# EAGLE design main (EAGLE 8.6.0)
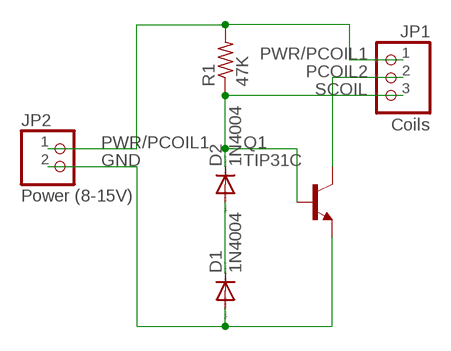
[diagram p0: schematic, sheet 1]

## Parts
D1  1N4004  [DO41-10]
D2  1N4004  [DO41-10]
JP1  Coils  PINHD-1X3  [1X03]
JP2  Power (8-15V)  PINHD-1X2  [1X02]
Q1  TIP31C  [TO220]
R1  47K  R-US_R2512  [R2512]

## Nets
GND: D1.A JP2.2 Q1.3(E)
N$1: D1.C D2.A
PCOIL2: JP1.2 Q1.2(C)
PWR/PCOIL1: JP1.1 JP2.1 R1.2
SCOIL: D2.C JP1.3 Q1.1(B) R1.1

## Library data of the parts
D1 D2 = diode:1N4004: DIODE general purpose rectifier, 1 A
JP1 = pinhead:PINHD-1X3: PIN HEADER
JP2 = pinhead:PINHD-1X2: PIN HEADER; SPICEPREFIX: B
Q1 = transistor-npn:TIP31C*: NPN Transistor
R1 = resistor:R-US_: RESISTOR, American symbol; DIGIKEY: https://www.digikey.com/product-detail/en/yageo/RC2512JK-0747KL/YAG2298CT-ND/5252412

## Board
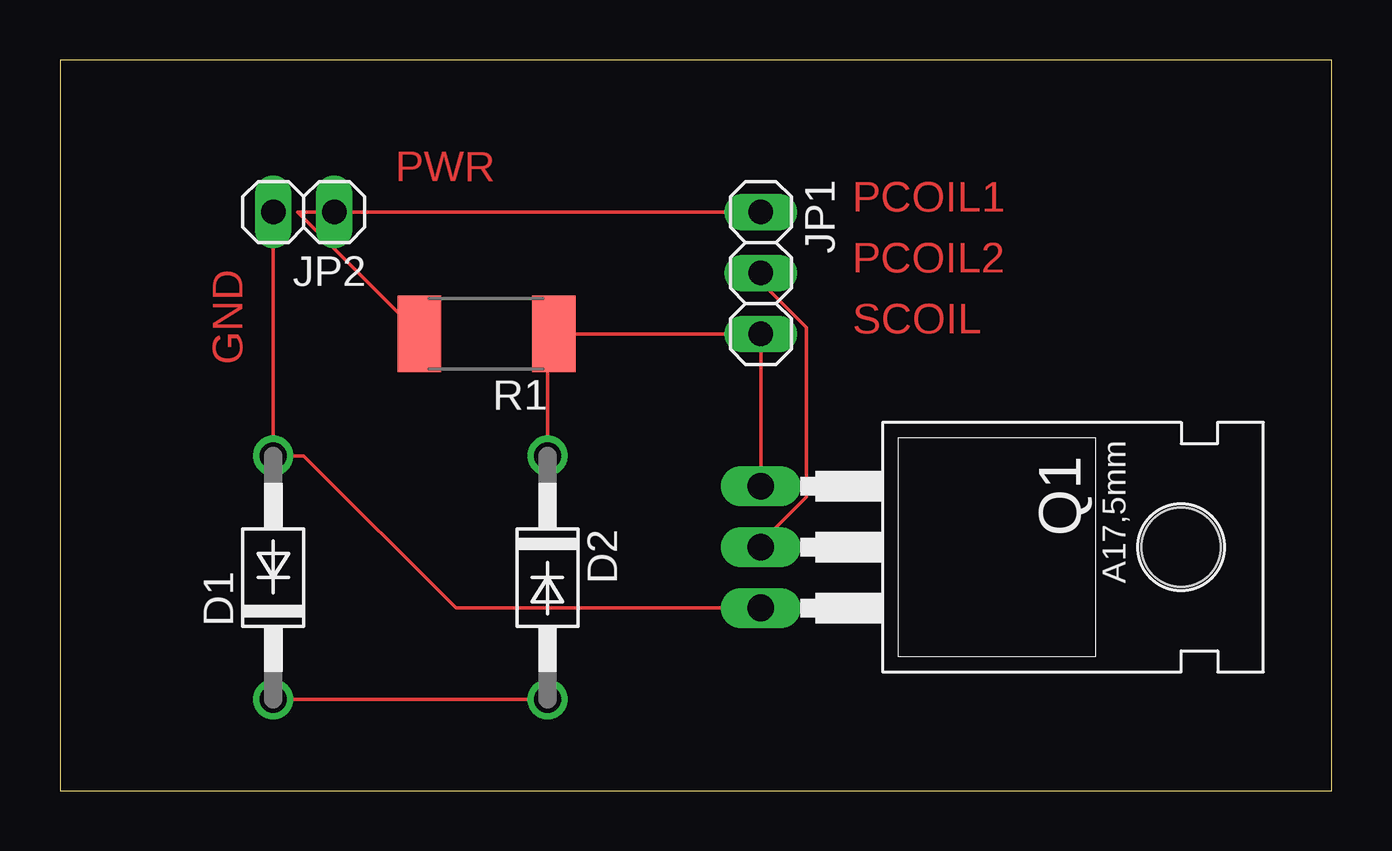
[diagram p1: board, top side]

Size 53.01 x 30.47 mm. Coordinates in mm from the lower left corner, seen from the top.
Outline: 0,0 53.01,0 53.01,30.47 0,30.47 0,0
Copper layers (1*16): Top 0.035mm / dielectric 1.5mm / Bottom 0.035mm
Design rules "default *": minimum track width 6mil, minimum drill 0.35mm, track to track 6mil, track to pad 6mil, pad to pad 6mil, via to via 6mil, smd to smd 6mil, copper to edge 40mil, drill to drill 6mil, minimum pad ring 10mil, minimum via ring 8mil, stop-mask expansion 4mil, vias tented up to drill 0mil, thermal gap 10mil

### Footprints (pad centres in the part's own frame; a part is rotated, then mirrored left to right if it is on the bottom)
DO41-10 = drill 1.118: A 5.08,0; C -5.08,0
1X03 = drill 1.016 long: 1 -2.54,0; 2 0,0; 3 2.54,0
1X02 = drill 1.016 long: 1 -1.27,0; 2 1.27,0
TO220 = drill 1.118 long: 1 -2.54,-6.35; 2 0,-6.35; 3 2.54,-6.35 | hole 3.302: 0,11.176
R2512 = smd 1.8 x 3.2: 1 -2.8,0; 2 2.8,0

### Placement (x,y rotation side)
D1  8.89,8.89 90 top
D2  20.32,8.89 270 top
JP1  29.21,21.59 270 top
JP2  10.16,24.13 180 top
Q1  35.56,10.16 270 top
R1  17.78,19.05 180 top

### Tracks (layer width: path | path; a pad name or v marks a point on that pad's centre or on a via)
GND
  Top 0.152: JP2.2 D1.A 10.16,13.97 16.51,7.62 Q1.3
N$1
  Top 0.152: D1.C D2.A
PCOIL2
  Top 0.152: Q1.2 29.21,10.35 31.11,12.26 31.11,19.31 29.21,21.21 JP1.2
PWR/PCOIL1
  Top 0.152: R1.2 9.9,24.13 JP2.1 JP1.1
SCOIL
  Top 0.152: D2.C 20.32,18.79 R1.1 JP1.3 Q1.1

### Text on the board
Top: PWR | PCOIL1 | PCOIL2 | SCOIL | GND